# Altium schematic sheet ASwitch.SchDoc
size A4
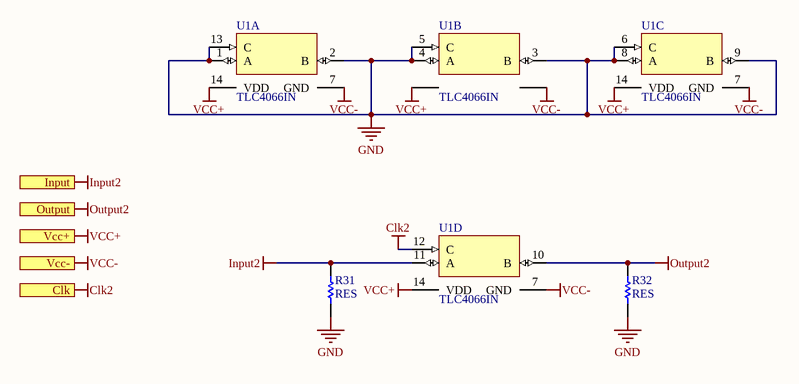
[diagram p0: ASwitch.SchDoc]

## Parts
R31  RES  [0805]
R32  RES  [0805]
U1  TLC4066IN  [N014]  (parts A,B,C,D of 4)

## Ports
Clk, Input, Output, Vcc+, Vcc-

## Nets
Clk2: U1.12(C) ; port Clk
GND: R31.1 R32.1 U1.1(A) U1.2(B) U1.3(B) U1.4(A) U1.5(C) U1.6(C) U1.7(GND) U1.8(A) U1.9(B) U1.13(C) ; port Vcc-  [also labelled VCC-]
Input2: R31.2 U1.11(A) ; port Input
Output2: R32.2 U1.10(B) ; port Output
VCC+: U1.14(VDD) ; port Vcc+  [also labelled VDD]

## Library data of the parts
U1 = TLC4066IN: Quadruple Bilateral Analog Switch; Published: 8-Jun-2000; LatestRevisionDate: 04-Mar-2005; LatestRevisionNote: Stylized 3D Model Added.; DatasheetVersion: Jan-1986; PackageVersion: Oct-1995; PackageReference: N014; Publisher: Altium Limited; PackageDescription: DIP; 14 Leads; Row Spacing 7.62 mm; Pitch 2.54 mm; ComponentLink1Description: Manufacturer Link; ComponentLink1URL: http://www.ti.com/